# Altium schematic sheet Boost_stage_closed_loop.SchDoc
size A4
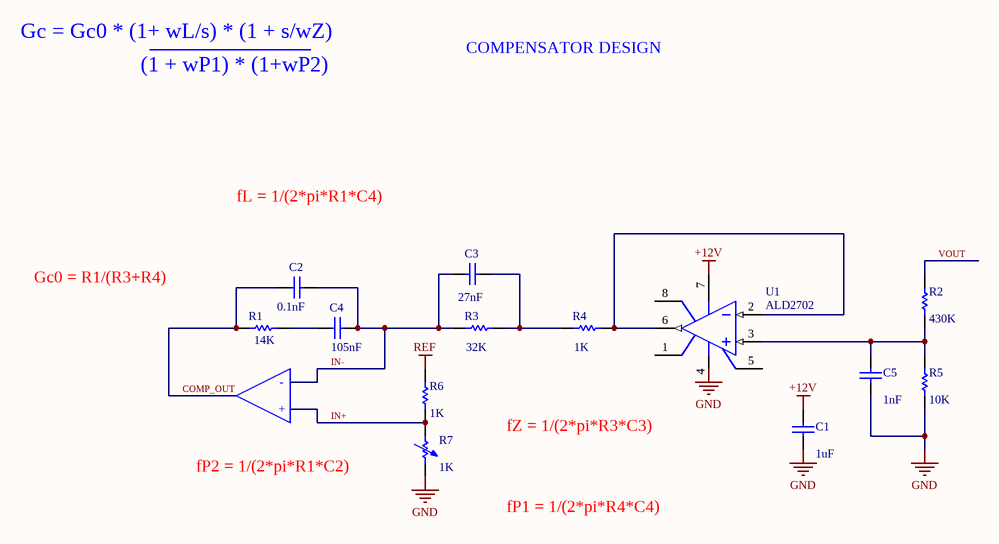
[diagram p0: Boost_stage_closed_loop.SchDoc]

## Parts
C1  value 1uF  [RAD-0.3]
C2  value 0.1nF  [RAD-0.3]
C3  value 27nF  [RAD-0.3]
C4  value 105nF  [RAD-0.3]
C5  value 1nF  [RAD-0.3]
R1  value 14K  [AXIAL-0.3]
R2  value 430K  [AXIAL-0.3]
R3  value 32K  [AXIAL-0.3]
R4  value 1K  [AXIAL-0.3]
R5  value 10K  [AXIAL-0.3]
R6  value 1K  [AXIAL-0.3]
R7  value 1K  [AXIAL-0.7]  (hidden comment: Res Adj1)
U1  ALD2702  [H-08A]

## Nets
+12V: C1.1 U1.7(V+)
GND: C1.2 C5.1 R5.1 R7.2
REF: R6.1
COMP_OUT: C2.2 R1.2
IN+: R6.2 R7.1
IN-: C2.1 C3.1 C4.1 R3.2
VOUT: R2.2
NetC3_2: C3.2 R3.1 R4.2
NetC4_2: C4.2 R1.1
NetC5_2: C5.2 R2.1 R5.2 U1.3(IN+)
NetR4_1: R4.1 U1.2(IN-) U1.6(OUT)

Not connected (* = marked no-connect by the designer): U1 1(OS_NUL) 4(V-) 5(OS_NUL) 8(TAB)

## Notes on the sheet
- Gc = Gc0 * (1+ wL/s) * (1 + s/wZ)
- (1 + wP1) * (1+wP2)
- COMPENSATOR DESIGN
- fL = 1/(2*pi*R1*C4)
- Gc0 = R1/(R3+R4)
- +
- -
- (near U1) fZ = 1/(2*pi*R3*C3)
- fP2 = 1/(2*pi*R1*C2)
- fP1 = 1/(2*pi*R4*C4)
- Labels drawn without touching a wire or pin: GND

## Library data of the parts
C1-C5 = Cap: Capacitor; Published: 8-Jun-2000; LatestRevisionDate: 17-Jul-2002; LatestRevisionNote: Re-released for DXP Platform.; PackageReference: RAD-0.3; Publisher: Altium Limited; PackageDescription: Radial Cap, Thru-Hole; 2 Leads; 0.3 in Pin Spacing
R1-R6 = Res1: Resistor; Published: 8-Jun-2000; LatestRevisionDate: 17-Jul-2002; LatestRevisionNote: Re-released for DXP Platform.; PackageReference: AXIAL-0.3; Publisher: Altium Limited; PackageDescription: Axial Device, Thru-Hole; 2 Leads; 0.3 in Pin Spacing
R7 = Res Adj1: Variable Resistor; Set Position: 0.5; Published: 8-Jun-2000; LatestRevisionDate: 17-Jul-2002; LatestRevisionNote: Re-released for DXP Platform.; PackageReference: AXIAL-0.7; Publisher: Altium Limited; PackageDescription: Axial Device, Thru-Hole; 2 Leads; 0.7 in Pin Spacing
U1 = Op Amp: FET Operational Amplifier; Published: 8-Jun-2000; LatestRevisionDate: 17-Jul-2002; LatestRevisionNote: Re-released for DXP Platform.; DatasheetVersion: REV. B; PackageVersion: 1990; PackageReference: H-08A; Publisher: Altium Limited; PackageDescription: Can; 8 Leads; Pin Circle Dia. 5.08 mm; Lead Dia. 0.53 mm (max); ComponentLink1Description: Manufacturer Link; ComponentLink1URL: http://www.analog.com/